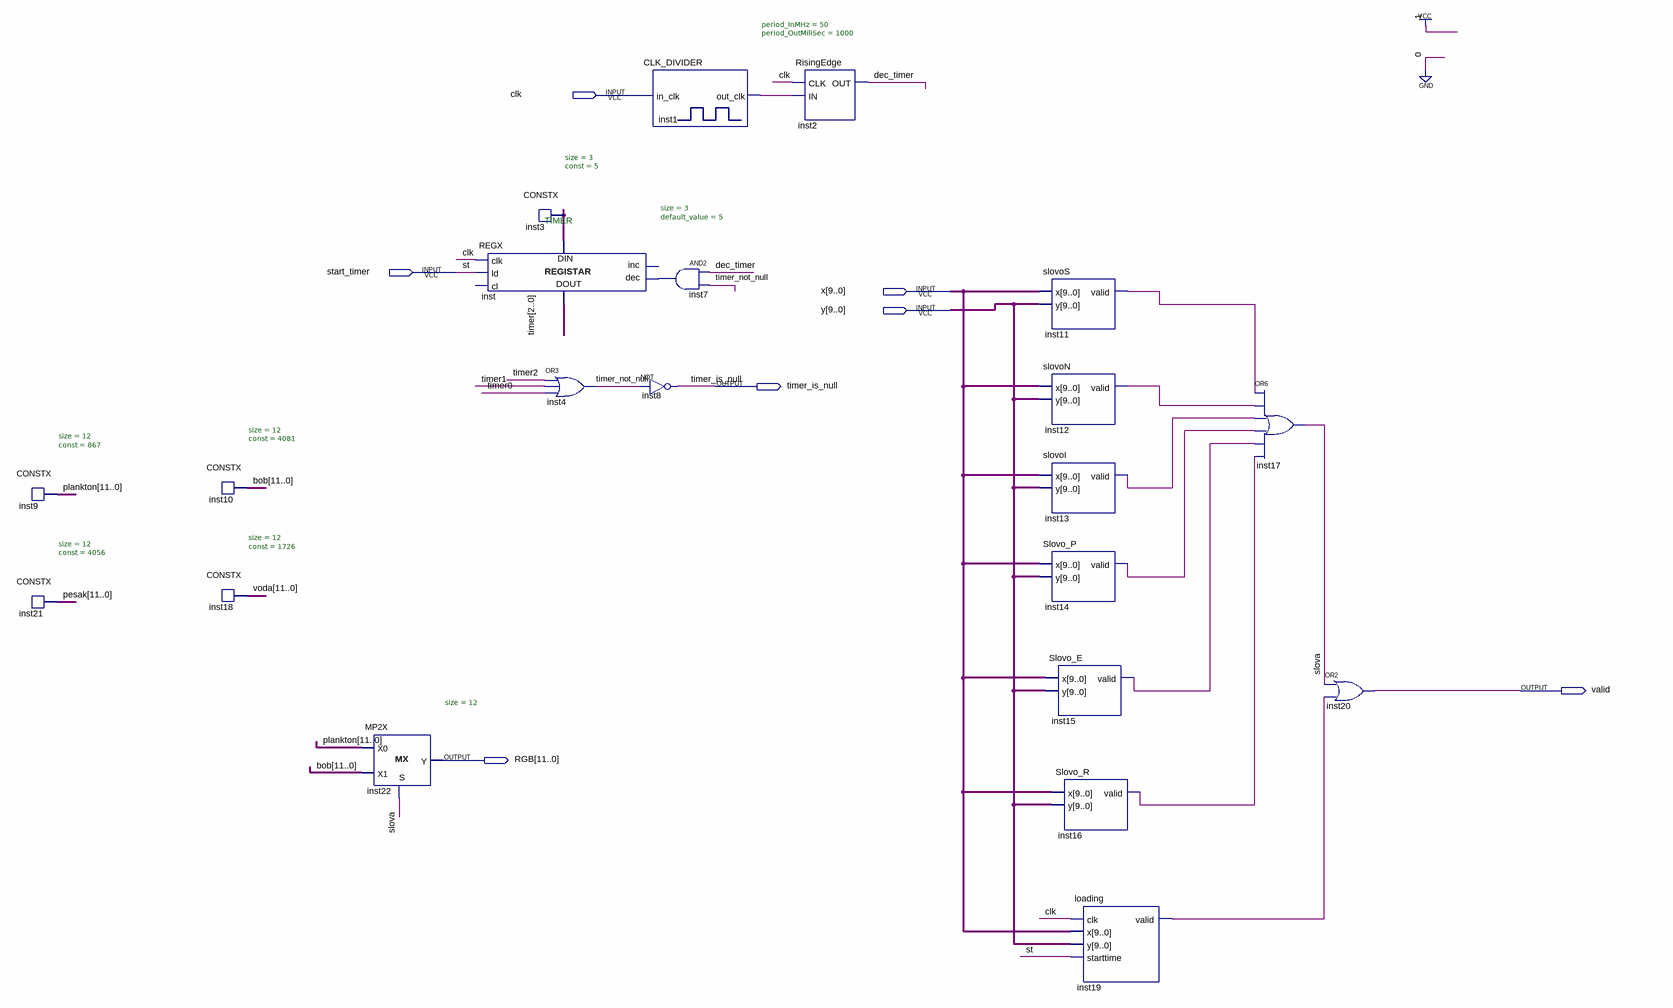
[diagram p0: schematic sheet]
// Quartus schematic StartScreen.bdf as structural Verilog: 21 symbols, 7 pins
module StartScreen (
  input  clk,
  input  start_timer,
  input  [9:0] x,
  input  [9:0] y,
  output timer_is_null,
  output valid,
  output [11:0] RGB
);

  wire dec_timer, inst1_out_clk, inst7_out, inst11_valid, inst12_valid, inst13_valid, inst14_valid,
       inst15_valid, inst16_valid, inst19_valid, slova, timer_not_null;
  wire [2:0] inst3_data, timer;
  wire [11:0] bob, pesak, plankton, voda;

  CONSTX #(.size(12), .\const (867)) inst9 (.data(plankton));
  CONSTX #(.size(12), .\const (4056)) inst21 (.data(pesak));
  CONSTX #(.size(12), .\const (4081)) inst10 (.data(bob));
  CONSTX #(.size(12), .\const (1726)) inst18 (.data(voda));
  MP2X #(.size(12)) inst22 (.S(slova), .X0(plankton), .X1(bob), .Y(RGB));
  REGX #(.size(3), .default_value(5)) inst (
    .clk(clk), .ld(start_timer), .dec(inst7_out), .data_in(inst3_data), .data_out(timer));  // open: cl, inc
  CONSTX #(.size(3), .\const (5)) inst3 (.data(inst3_data));
  or inst4 (timer_not_null, timer[2], timer[1], timer[0]);
  CLK_DIVIDER #(.period_InMHz(50), .period_OutMiliSec(1000)) inst1 (.in_clk(clk), .out_clk(inst1_out_clk));
  not inst8 (timer_is_null, timer_not_null);
  and inst7 (inst7_out, dec_timer, timer_not_null);
  RisingEdge inst2 (.CLK(clk), .IN(inst1_out_clk), .OUT(dec_timer));
  slovoS inst11 (.x(x), .y(y), .valid(inst11_valid));
  slovoN inst12 (.x(x), .y(y), .valid(inst12_valid));
  slovoI inst13 (.x(x), .y(y), .valid(inst13_valid));
  Slovo_P inst14 (.x(x), .y(y), .valid(inst14_valid));
  Slovo_E inst15 (.x(x), .y(y), .valid(inst15_valid));
  Slovo_R inst16 (.x(x), .y(y), .valid(inst16_valid));
  loading inst19 (.clk(clk), .x(x), .y(y), .starttime(start_timer), .valid(inst19_valid));
  or inst17 (slova, inst11_valid, inst12_valid, inst13_valid, inst14_valid, inst15_valid, inst16_valid);
  or inst20 (valid, slova, inst19_valid);

  // Other names for the same wires on the sheet: st = start_timer

  // Notes on the sheet:
  //   TIMER
endmodule
